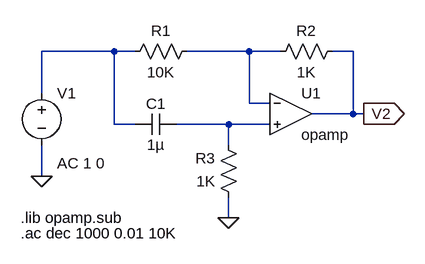
[diagram p0: schematic CircTarea0.asc]
CircTarea0.asc, the LTspice schematic file:
Version 4.1
SHEET 1 880 680
WIRE 0 96 -112 96
WIRE 32 96 0 96
WIRE 208 96 112 96
WIRE 256 96 208 96
WIRE 368 96 336 96
WIRE -112 160 -112 96
WIRE 208 176 208 96
WIRE 240 176 208 176
WIRE 368 192 368 96
WIRE 368 192 304 192
WIRE 384 192 368 192
WIRE 0 208 0 96
WIRE 32 208 0 208
WIRE 176 208 96 208
WIRE 240 208 176 208
WIRE 176 240 176 208
WIRE -112 288 -112 240
WIRE 176 352 176 320
FLAG -112 288 0
FLAG 384 192 V2
IOPIN 384 192 Out
FLAG 176 352 0
SYMBOL res 128 80 R90
WINDOW 0 0 56 VBottom 2
WINDOW 3 32 56 VTop 2
SYMATTR InstName R1
SYMATTR Value 10K
SYMBOL res 352 80 R90
WINDOW 0 0 56 VBottom 2
WINDOW 3 32 56 VTop 2
SYMATTR InstName R2
SYMATTR Value 1K
SYMBOL res 192 336 R180
WINDOW 0 36 76 Left 2
WINDOW 3 36 40 Left 2
SYMATTR InstName R3
SYMATTR Value 1K
SYMBOL cap 96 192 R90
WINDOW 0 0 32 VBottom 2
WINDOW 3 32 32 VTop 2
SYMATTR InstName C1
SYMATTR Value 1µ
SYMBOL OpAmps\\opamp 272 128 R0
SYMATTR InstName U1
SYMBOL voltage -112 144 R0
WINDOW 123 24 124 Left 2
WINDOW 39 0 0 Left 0
SYMATTR Value2 AC 1 0
SYMATTR InstName V1
SYMATTR Value ""
TEXT -144 376 Left 2 !.ac dec 1000 0.01 10K
TEXT -144 352 Left 2 !.lib opamp.sub

The netlist it stands for:
* CircTarea0.asc
R1 N002 N001 10K
R2 V2 N002 1K
R3 0 N003 1K
C1 N003 N001 1µ
X§U1 N002 N003 V2 opamp Aol=100K GBW=10Meg  ; pins invin noninvin out
V1 N001 0 AC 1 0
.ac dec 1000 0.01 10K
.lib opamp.sub
.backanno
.end